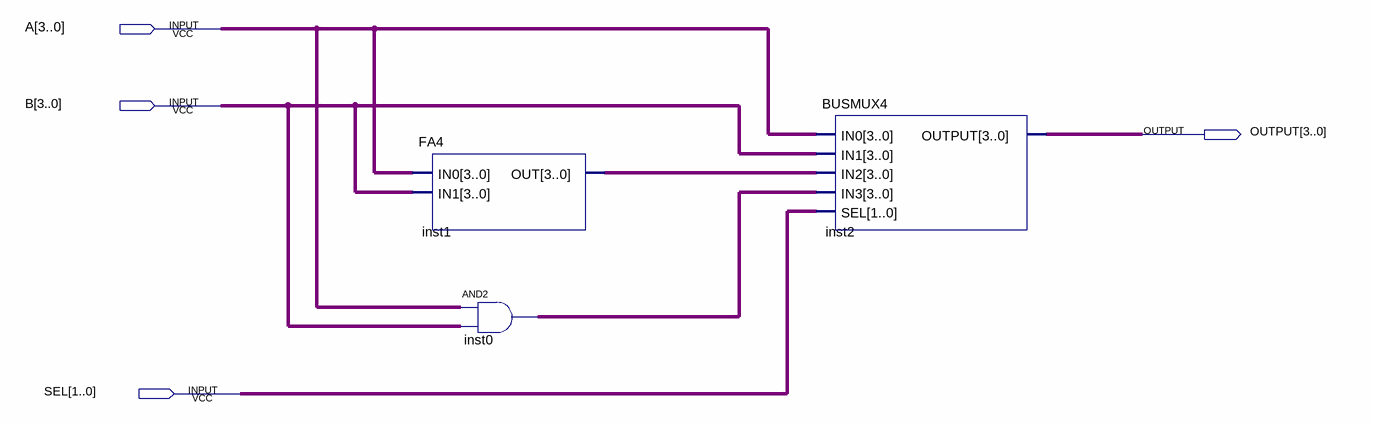
[diagram p0: schematic sheet]
// Quartus schematic ALU.bdf as structural Verilog: 3 symbols, 4 pins
module ALU (
  input  [3:0] A,
  input  [3:0] B,
  input  [1:0] SEL,
  output [3:0] OUTPUT
);

  wire [3:0] inst0_out, inst1_out;

  FA4 inst1 (.IN0(A), .IN1(B), .OUT(inst1_out));
  assign inst0_out = A & B;  // AND2 inst0, 4 bits wide
  BUSMUX4 inst2 (.IN0(A), .IN1(B), .IN2(inst1_out), .IN3(inst0_out), .SEL(SEL), .OUTPUT(OUTPUT));
endmodule
